# EAGLE design board (EAGLE 6.6.0)
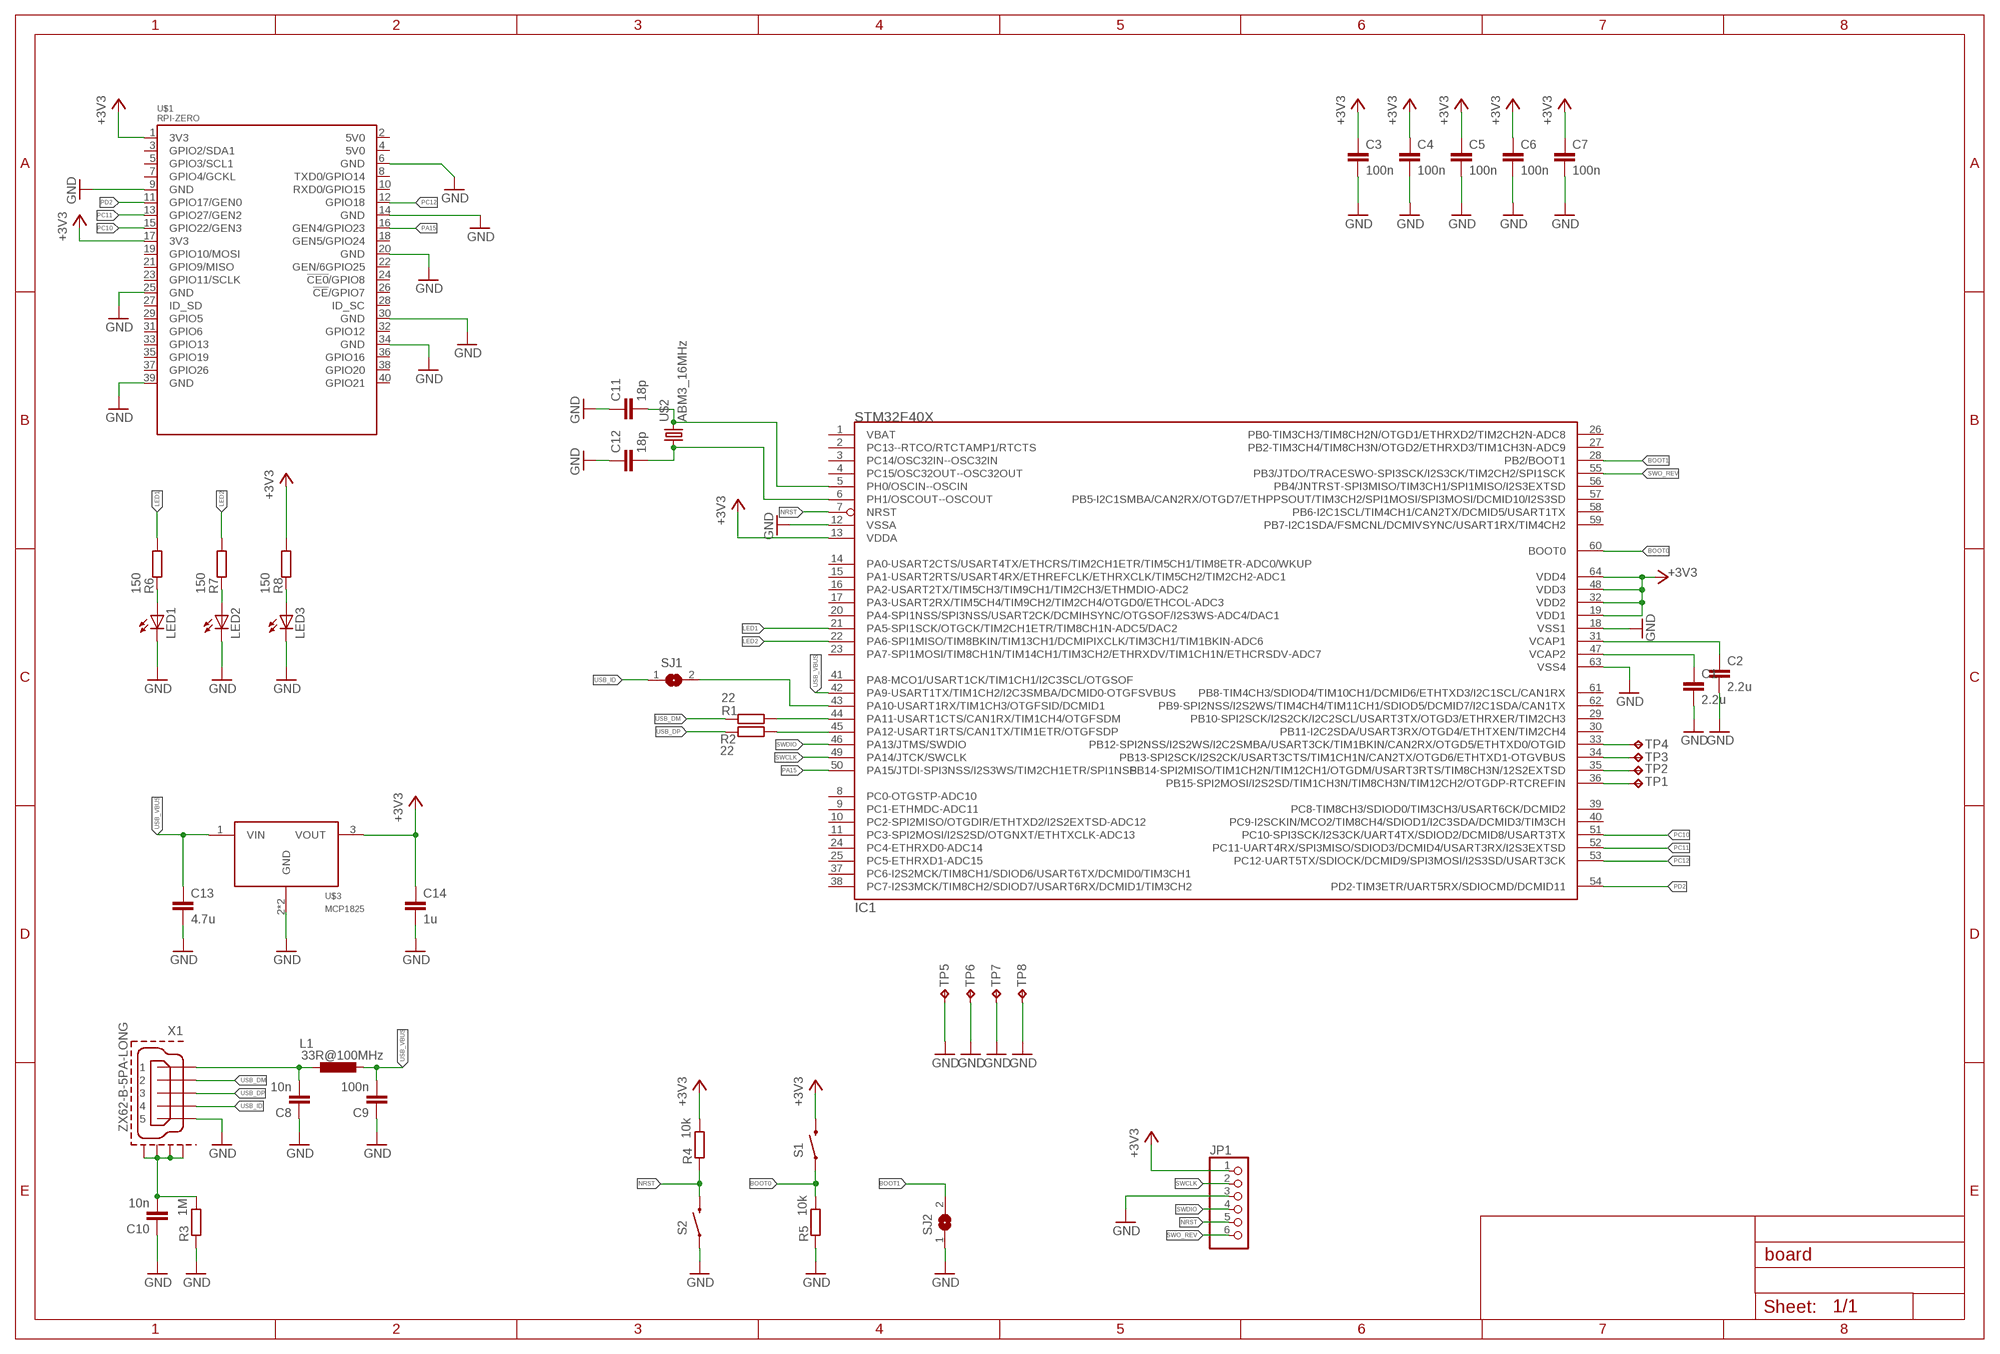
[diagram p0: schematic, sheet 1]

## Parts
C1  2.2u  C-EUC0805  [C0805]
C2  2.2u  C-EUC0805  [C0805]
C3  100n  C-EUC0603  [C0603]
C4  100n  C-EUC0603  [C0603]
C5  100n  C-EUC0603  [C0603]
C6  100n  C-EUC0603  [C0603]
C7  100n  C-EUC0603  [C0603]
C8  10n  C-EUC0603  [C0603]
C9  100n  C-EUC0603  [C0603]
C10  10n  C-EUC0603  [C0603]
C11  18p  C-EUC0603  [C0603]
C12  18p  C-EUC0603  [C0603]
C13  4.7u  C-EUC0805  [C0805]
C14  1u  C-EUC0805  [C0805]
IC1  STM32F40X  [LQFP64]
JP1  PINHD-1X6  [1X06]
L1  33R@100MHz  L-EUL2012C  [L2012C]
LED1  LEDCHIPLED_0805  [CHIPLED_0805]
LED2  LEDCHIPLED_0805  [CHIPLED_0805]
LED3  LEDCHIPLED_0805  [CHIPLED_0805]
R1  22  R-EU_R0603  [R0603]
R2  22  R-EU_R0603  [R0603]
R3  1M  R-EU_R0603  [R0603]
R4  10k  R-EU_R0603  [R0603]
R5  10k  R-EU_R0603  [R0603]
R6  150  R-EU_R0603  [R0603]
R7  150  R-EU_R0603  [R0603]
R8  150  R-EU_R0603  [R0603]
S1  SWITCH-MOMENTARY-2SMD  [TACTILE-SWITCH-SMD]
S2  SWITCH-MOMENTARY-2SMD  [TACTILE-SWITCH-SMD]
SJ1  SJ  [SJ]
SJ2  SJ  [SJ]
TP1  TPB1,27  [B1,27]
TP2  TPB1,27  [B1,27]
TP3  TPB1,27  [B1,27]
TP4  TPB1,27  [B1,27]
TP5  TPB1,27  [B1,27]
TP6  TPB1,27  [B1,27]
TP7  TPB1,27  [B1,27]
TP8  TPB1,27  [B1,27]
U$1  RPI-ZERO  [RASPBERRYPI_BASTELSTUBE_V13_RASPI_BOARD_B+_FULL]
U$2  ABM3_16MHz  ABRACON_ABM3_CRYSTAL  [ABRACON_ABM3_CRYSTAL]
U$3  MCP1825  [SOT223-3]
X1  ZX62-B-5PA-LONG  [ZX62-B-5PA-LONG]

## Nets
+3V3: C3.1 C4.1 C5.1 C6.1 C7.1 C14.1 IC1.13(VDDA) IC1.19(VDD1) IC1.32(VDD2) IC1.48(VDD3) IC1.64(VDD4) JP1.1 R4.2 R8.2 S1.3 U$1.1(3V3) U$1.17(3V3) U$3.3(VOUT)
BOOT0: IC1.60(BOOT0) R5.2 S1.1
BOOT1: IC1.28(PB2/BOOT1) SJ2.2
GND: C1.2 C2.2 C3.2 C4.2 C5.2 C6.2 C7.2 C8.1 C9.1 C10.1 C11.1 C12.1 C13.2 C14.2 IC1.12(VSSA) IC1.18(VSS1) IC1.63(VSS4) JP1.3 LED1.C LED2.C LED3.C R3.1 R5.1 S2.1 SJ2.1 TP5.TP TP6.TP TP7.TP TP8.TP U$1.6(GND) U$1.9(GND) U$1.14(GND) U$1.20(GND) U$1.25(GND) U$1.30(GND) U$1.34(GND) U$1.39(GND) U$3.2(GND) U$3.4(GND) X1.5
LED1: IC1.21(PA5-SPI1SCK/OTGCK/TIM2CH1ETR/TIM8CH1N-ADC5/DAC2) R6.2
LED2: IC1.22(PA6-SPI1MISO/TIM8BKIN/TIM13CH1/DCMIPIXCLK/TIM3CH1/TIM1BKIN-ADC6) R7.2
N$1: C8.2 L1.1 X1.1
N$2: C10.2 R3.2 X1.P$1(GND1) X1.P$2(GND2) X1.P$5(GND4) X1.P$6(GND3)
N$3: IC1.44(PA11-USART1CTS/CAN1RX/TIM1CH4/OTGFSDM) R1.2
N$4: IC1.45(PA12-USART1RTS/CAN1TX/TIM1ETR/OTGFSDP) R2.2
N$5: IC1.43(PA10-USART1RX/TIM1CH3/OTGFSID/DCMID1) SJ1.2
N$6: LED1.A R6.1
N$7: C12.2 IC1.6(PH1/OSCOUT--OSCOUT) U$2.P$1
N$8: C11.2 IC1.5(PH0/OSCIN--OSCIN) U$2.P$2
N$9: LED2.A R7.1
N$10: LED3.A R8.1
N$11: IC1.36(PB15-SPI2MOSI/I2S2SD/TIM1CH3N/TIM8CH3N/TIM12CH2/OTGDP-RTCREFIN) TP1.TP
N$12: IC1.35(PB14-SPI2MISO/TIM1CH2N/TIM12CH1/OTGDM/USART3RTS/TIM8CH3N/12S2EXTSD) TP2.TP
N$13: IC1.34(PB13-SPI2SCK/I2S2CK/USART3CTS/TIM1CH1N/CAN2TX/OTGD6/ETHTXD1-OTGVBUS) TP3.TP
N$14: IC1.33(PB12-SPI2NSS/I2S2WS/I2C2SMBA/USART3CK/TIM1BKIN/CAN2RX/OTGD5/ETHTXD0/OTGID) TP4.TP
NRST: IC1.7(NRST) JP1.5 R4.1 S2.3
PA15: IC1.50(PA15/JTDI-SPI3NSS/I2S3WS/TIM2CH1ETR/SPI1NSS) U$1.16(GEN4/GPIO23)
PC10: IC1.51(PC10-SPI3SCK/I2S3CK/UART4TX/SDIOD2/DCMID8/USART3TX) U$1.15(GPIO22/GEN3)
PC11: IC1.52(PC11-UART4RX/SPI3MISO/SDIOD3/DCMID4/USART3RX/I2S3EXTSD) U$1.13(GPIO27/GEN2)
PC12: IC1.53(PC12-UART5TX/SDIOCK/DCMID9/SPI3MOSI/I2S3SD/USART3CK) U$1.12(GPIO18)
PD2: IC1.54(PD2-TIM3ETR/UART5RX/SDIOCMD/DCMID11) U$1.11(GPIO17/GEN0)
SWCLK: IC1.49(PA14/JTCK/SWCLK) JP1.2
SWDIO: IC1.46(PA13/JTMS/SWDIO) JP1.4
SWO_REV: IC1.55(PB3/JTDO/TRACESWO-SPI3SCK/I2S3CK/TIM2CH2/SPI1SCK) JP1.6
USB_DM: R1.1 X1.2
USB_DP: R2.1 X1.3
USB_ID: SJ1.1 X1.4
USB_VBUS: C9.2 C13.1 IC1.42(PA9-USART1TX/TIM1CH2/I2C3SMBA/DCMID0-OTGFSVBUS) L1.2 U$3.1(VIN)
VCAP1: C2.1 IC1.31(VCAP1)
VCAP2: C1.1 IC1.47(VCAP2)
Unconnected: IC1.1(VBAT) IC1.2(PC13--RTCO/RTCTAMP1/RTCTS) IC1.3(PC14/OSC32IN--OSC32IN) IC1.4(PC15/OSC32OUT--OSC32OUT) IC1.8(PC0-OTGSTP-ADC10) IC1.9(PC1-ETHMDC-ADC11) IC1.10(PC2-SPI2MISO/OTGDIR/ETHTXD2/I2S2EXTSD-ADC12) IC1.11(PC3-SPI2MOSI/I2S2SD/OTGNXT/ETHTXCLK-ADC13) IC1.14(PA0-USART2CTS/USART4TX/ETHCRS/TIM2CH1ETR/TIM5CH1/TIM8ETR-ADC0/WKUP) IC1.15(PA1-USART2RTS/USART4RX/ETHREFCLK/ETHRXCLK/TIM5CH2/TIM2CH2-ADC1) IC1.16(PA2-USART2TX/TIM5CH3/TIM9CH1/TIM2CH3/ETHMDIO-ADC2) IC1.17(PA3-USART2RX/TIM5CH4/TIM9CH2/TIM2CH4/OTGD0/ETHCOL-ADC3) IC1.20(PA4-SPI1NSS/SPI3NSS/USART2CK/DCMIHSYNC/OTGSOF/I2S3WS-ADC4/DAC1) IC1.23(PA7-SPI1MOSI/TIM8CH1N/TIM14CH1/TIM3CH2/ETHRXDV/TIM1CH1N/ETHCRSDV-ADC7) IC1.24(PC4-ETHRXD0-ADC14) IC1.25(PC5-ETHRXD1-ADC15) IC1.26(PB0-TIM3CH3/TIM8CH2N/OTGD1/ETHRXD2/TIM2CH2N-ADC8) IC1.27(PB2-TIM3CH4/TIM8CH3N/OTGD2/ETHRXD3/TIM1CH3N-ADC9) IC1.29(PB10-SPI2SCK/I2S2CK/I2C2SCL/USART3TX/OTGD3/ETHRXER/TIM2CH3) IC1.30(PB11-I2C2SDA/USART3RX/OTGD4/ETHTXEN/TIM2CH4) IC1.37(PC6-I2S2MCK/TIM8CH1/SDIOD6/USART6TX/DCMID0/TIM3CH1) IC1.38(PC7-I2S3MCK/TIM8CH2/SDIOD7/USART6RX/DCMID1/TIM3CH2) IC1.39(PC8-TIM8CH3/SDIOD0/TIM3CH3/USART6CK/DCMID2) IC1.40(PC9-I2SCKIN/MCO2/TIM8CH4/SDIOD1/I2C3SDA/DCMID3/TIM3CH) IC1.41(PA8-MCO1/USART1CK/TIM1CH1/I2C3SCL/OTGSOF) IC1.56(PB4/JNTRST-SPI3MISO/TIM3CH1/SPI1MISO/I2S3EXTSD) IC1.57(PB5-I2C1SMBA/CAN2RX/OTGD7/ETHPPSOUT/TIM3CH2/SPI1MOSI/SPI3MOSI/DCMID10/I2S3SD) IC1.58(PB6-I2C1SCL/TIM4CH1/CAN2TX/DCMID5/USART1TX) IC1.59(PB7-I2C1SDA/FSMCNL/DCMIVSYNC/USART1RX/TIM4CH2) IC1.61(PB8-TIM4CH3/SDIOD4/TIM10CH1/DCMID6/ETHTXD3/I2C1SCL/CAN1RX) IC1.62(PB9-SPI2NSS/I2S2WS/TIM4CH4/TIM11CH1/SDIOD5/DCMID7/I2C1SDA/CAN1TX) U$1.2(5V0) U$1.3(GPIO2/SDA1) U$1.4(5V0) U$1.5(GPIO3/SCL1) U$1.7(GPIO4/GCKL) U$1.8(TXD0/GPIO14) U$1.10(RXD0/GPIO15) U$1.18(GEN5/GPIO24) U$1.19(GPIO10/MOSI) U$1.21(GPIO9/MISO) U$1.22(GEN/6GPIO25) U$1.23(GPIO11/SCLK) U$1.24(!CE0!/GPIO8) U$1.26(!CE!/GPIO7) U$1.27(ID_SD) U$1.28(ID_SC) U$1.29(GPIO5) U$1.31(GPIO6) U$1.32(GPIO12) U$1.33(GPIO13) U$1.35(GPIO19) U$1.36(GPIO16) U$1.37(GPIO26) U$1.38(GPIO20) U$1.40(GPIO21)

## Library data of the parts
C1-C14 = rcl:C-EU: CAPACITOR, European symbol
IC1 = pel_stm32:STM32F40X
JP1 = pinhead:PINHD-1X6: PIN HEADER
L1 = rcl:L-EU: INDUCTOR, European symbol
LED1-LED3 = led:LED: LED OSRAM: - CHIPLED LG R971, LG N971, LY N971, LG Q971, LY Q971, LO R971, LY R971 LH N974, LH R974 LS Q976, LO Q976, LY Q976 LO Q996 - Hyper CHIPLED LW Q18S LB Q993, LB Q99A, LB R99A - SideLED LS A670, LO A670, LY A670, LG A670, LP A670 LB A673, LV A673, LT A673, LW A673 LH A674 LY A675 LS A676, LA A676, LO A676, LY A676, LW A676 LS A679, LY A679, LG A679 - Hyper Micro SIDELED® LS Y876, LA Y876, LO Y876, LY Y876 LT Y87S - SmartLED LW L88C, LW L88S LB L89C, LB L89S, LG L890 LS L89K, LO L89K, LY L89K LS L896, LA L896, LO L896, LY L896 - TOPLED LS T670, LO T670, LY T670, LG T670, LP T670 LSG T670, LSP T670, LSY T670, LOP T670, LYG T670 LG T671, LOG T671, LSG T671 LB T673, LV T673, LT T673, LW T673 LH T674 LS T676, LA T676, LO T676, LY T676, LB T676, LH T676, LSB T676, LW T676 LB T67C, LV T67C, LT T67C, LS T67K, LO T67K, LY T67K, LW E67C LS E67B, LA E67B, LO E67B, LY E67B, LB E67C, LV E67C, LT E67C LW T67C LS T679, LY T679, LG T679 LS T770, LO T770, LY T770, LG T770, LP T770 LB T773, LV T773, LT T773, LW T773 LH T774 LS E675, LA E675, LY E675, LS T675 LS T776, LA T776, LO T776, LY T776, LB T776 LHGB T686 LT T68C, LB T68C - Hyper Mini TOPLED® LB M676 - Mini TOPLED Santana® LG M470 LS M47K, LO M47K, LY M47K Source: http://www.osram.convergy.de LUXEON: - LUMILED® LXK2-PW12-R00, LXK2-PW12-S00, LXK2-PW14-U00, LXK2-PW14-V00 LXK2-PM12-R00, LXK2-PM12-S00, LXK2-PM14-U00 LXK2-PE12-Q00, LXK2-PE12-R00, LXK2-PE12-S00, LXK2-PE14-T00, LXK2-PE14-U00 LXK2-PB12-K00, LXK2-PB12-L00, LXK2-PB12-M00, LXK2-PB14-N00, LXK2-PB14-P00, LXK2-PB14-Q00 LXK2-PR12-L00, LXK2-PR12-M00, LXK2-PR14-Q00, LXK2-PR14-R00 LXK2-PD12-Q00, LXK2-PD12-R00, LXK2-PD12-S00 LXK2-PH12-R00, LXK2-PH12-S00 LXK2-PL12-P00, LXK2-PL12-Q00, LXK2-PL12-R00 Source: www.luxeon.com KINGBRIGHT: KA-3528ASYC Source: www.kingbright.com
R1-R8 = rcl:R-EU_: RESISTOR, European symbol
S1 S2 = SparkFun-Electromechanical:SWITCH-MOMENTARY-2: Various NO switches- pushbuttons, reed, etc; PROD_ID: SWCH-08247
SJ1 SJ2 = jumper:SJ: SMD solder JUMPER
TP1-TP8 = testpad:TP: Test pad
U$1 = RPI-Zero:RPI-ZERO
U$2 = Ava:ABRACON_ABM3_CRYSTAL
U$3 = mcp1825:MCP1825
X1 = Hirose-USB:ZX62-B-5PA

## Board
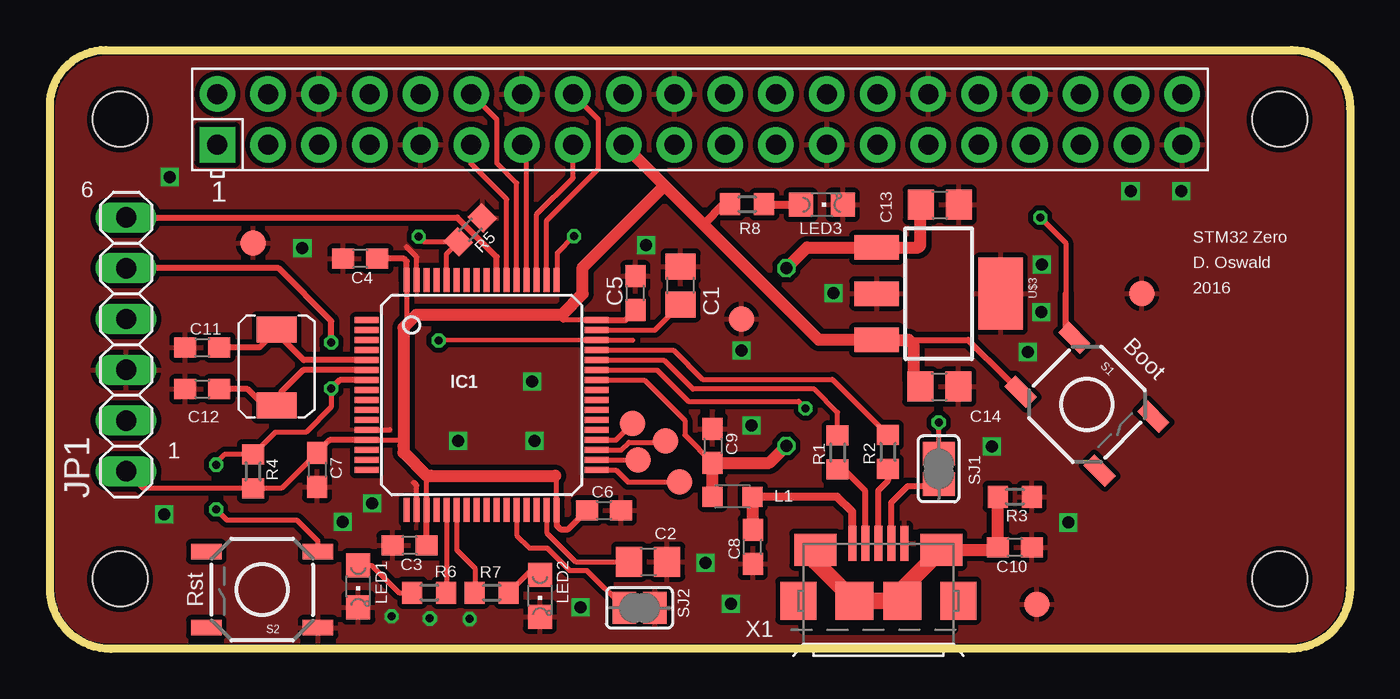
[diagram p1: board, top side]
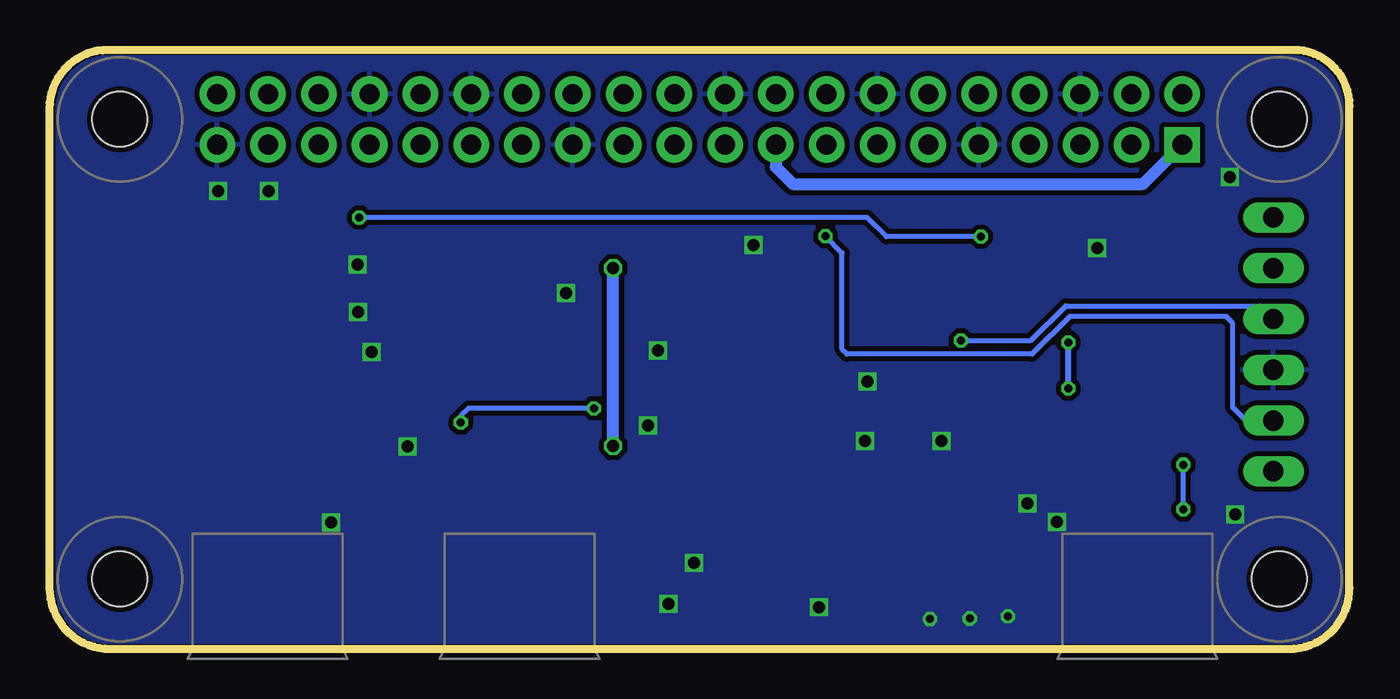
[diagram p2: board, bottom side, seen from below]

Size 65 x 29.97 mm. Coordinates in mm from the lower left corner, seen from the top.
Outline: 0,27.03 arc-90 2.95,29.97 62.03,29.97 arc-90 65,27 65,3.05 arc-90 61.95,0 3,0 arc-90 0,3 0,27.03
Copper layers (1*16): Top 0.035mm / dielectric 1.5mm / Bottom 0.035mm
Design rules "dirt_cheap_dirty_boards.v1": minimum track width 5mil, minimum drill 12mil, track to track 5mil, track to pad 5mil, pad to pad 5mil, via to via 5mil, smd to smd 0mil, copper to edge 10mil, drill to drill 10mil, minimum pad ring 10mil, minimum via ring 6mil, stop-mask expansion 2mil, vias tented up to drill 25mil, thermal gap 10mil
Milling: 8 lines

### Footprints (pad centres in the part's own frame; a part is rotated, then mirrored left to right if it is on the bottom)
C0805 = smd 1.3 x 1.5: 1 -0.95,0; 2 0.95,0
C0603 = smd 1.1 x 1: 1 -0.85,0; 2 0.85,0
LQFP64 = smd 1.2 x 0.3: 1 -5.75,3.75; 2 -5.75,3.25; 3 -5.75,2.75; 4 -5.75,2.25; 5 -5.75,1.75; 6 -5.75,1.25; 7 -5.75,0.75; 8 -5.75,0.25; 9 -5.75,-0.25; 10 -5.75,-0.75; 11 -5.75,-1.25; 12 -5.75,-1.75; 13 -5.75,-2.25; 14 -5.75,-2.75; 15 -5.75,-3.25; 16 -5.75,-3.75; 33 5.75,-3.75; 34 5.75,-3.25; 35 5.75,-2.75; 36 5.75,-2.25; 37 5.75,-1.75; 38 5.75,-1.25; 39 5.75,-0.75; 40 5.75,-0.25; 41 5.75,0.25; 42 5.75,0.75; 43 5.75,1.25; 44 5.75,1.75; 45 5.75,2.25; 46 5.75,2.75; 47 5.75,3.25; 48 5.75,3.75 | smd 0.3 x 1.2: 17 -3.75,-5.75; 18 -3.25,-5.75; 19 -2.75,-5.75; 20 -2.25,-5.75; 21 -1.75,-5.75; 22 -1.25,-5.75; 23 -0.75,-5.75; 24 -0.25,-5.75; 25 0.25,-5.75; 26 0.75,-5.75; 27 1.25,-5.75; 28 1.75,-5.75; 29 2.25,-5.75; 30 2.75,-5.75; 31 3.25,-5.75; 32 3.75,-5.75; 49 3.75,5.75; 50 3.25,5.75; 51 2.75,5.75; 52 2.25,5.75; 53 1.75,5.75; 54 1.25,5.75; 55 0.75,5.75; 56 0.25,5.75; 57 -0.25,5.75; 58 -0.75,5.75; 59 -1.25,5.75; 60 -1.75,5.75; 61 -2.25,5.75; 62 -2.75,5.75; 63 -3.25,5.75; 64 -3.75,5.75
1X06 = drill 1.016 long: 1 -6.35,0; 2 -3.81,0; 3 -1.27,0; 4 1.27,0; 5 3.81,0; 6 6.35,0
L2012C = smd 1 x 1: 1 -1,0; 2 1,0
CHIPLED_0805 = smd 1.2 x 1.2: A 0,-1.05; C 0,1.05
R0603 = smd 1 x 1.1: 1 -0.85,0; 2 0.85,0
TACTILE-SWITCH-SMD = smd 1.524 x 0.762: 1 -2.794,1.905; 2 2.794,1.905; 3 -2.794,-1.905; 4 2.794,-1.905
SJ = smd 1.168 x 1.6: 1 -0.762,0; 2 0.762,0
B1,27 = smd 1.27 x 1.27: TP 0,0
RASPBERRYPI_BASTELSTUBE_V13_RASPI_BOARD_B+_FULL = drill 1 pad 1.778 square: 1 8.37,25.23 | drill 1 pad 1.778: 2 8.37,27.77; 3 10.91,25.23; 4 10.91,27.77; 5 13.45,25.23; 6 13.45,27.77; 7 15.99,25.23; 8 15.99,27.77; 9 18.53,25.23; 10 18.53,27.77; 11 21.07,25.23; 12 21.07,27.77; 13 23.61,25.23; 14 23.61,27.77; 15 26.15,25.23; 16 26.15,27.77; 17 28.69,25.23; 18 28.69,27.77; 19 31.23,25.23; 20 31.23,27.77; 21 33.77,25.23; 22 33.77,27.77; 23 36.31,25.23; 24 36.31,27.77; 25 38.85,25.23; 26 38.85,27.77; 27 41.39,25.23; 28 41.39,27.77; 29 43.93,25.23; 30 43.93,27.77; 31 46.47,25.23; 32 46.47,27.77; 33 49.01,25.23; 34 49.01,27.77; 35 51.55,25.23; 36 51.55,27.77; 37 54.09,25.23; 38 54.09,27.77; 39 56.63,25.23; 40 56.63,27.77 | hole 2.75: 3.5,3.5; 3.5,26.5; 61.5,3.5; 61.5,26.5
ABRACON_ABM3_CRYSTAL = smd 1.3 x 2: P$1 -3.4,0.1; P$2 0.4,0.1
SOT223-3 = smd 1.219 x 2.235: 1 0.229,-8.179; 2 2.54,-8.179; 3 4.851,-8.179 | smd 3.6 x 2.2: 4 2.54,-1.981
ZX62-B-5PA-LONG = smd 0.4 x 1.75: 1 -1.3,2.875; 2 -0.65,2.875; 3 0,2.875; 4 0.65,2.875; 5 1.3,2.875 | smd 2.1 x 1.6: P$1 -3.15,2.55; P$2 3.15,2.55 | smd 1.8 x 1.9: P$3 -4,0; P$4 4,0 | smd 1.9 x 1.9: P$5 -1.2,0; P$6 1.2,0

### Placement (x,y rotation side)
C1  31.55,18.19 90 top
C2  29.92,4.37 0 top
C3  17.98,5.18 180 top
C4  15.52,19.53 180 top
C5  29.29,17.81 90 top
C6  27.71,6.93 0 top
C7  13.36,8.97 270 top
C8  35.15,5.11 90 top
C9  33.15,10.16 270 top
C10  48.26,5.08 180 top
C11  7.62,15.09 0 top
C12  7.62,13 0 top
C13  44.5,22.23 0 top
C14  44.48,13.13 0 top
IC1  21.59,12.7 0 top
JP1  3.81,15.24 90 top
L1  34.14,7.62 180 top
LED1  15.42,3.12 180 top
LED2  24.51,2.67 180 top
LED3  38.61,22.23 270 top
R1  39.4,9.83 90 top
R2  41.91,9.86 90 top
R3  48.26,7.62 180 top
R4  10.16,8.89 270 top
R5  21.03,20.97 225 top
R6  18.97,2.82 0 top
R7  22.1,2.82 180 top
R8  34.87,22.25 180 top
S1  51.87,12.24 315 top
S2  10.62,2.97 180 top
SJ1  44.45,9.02 90 top
SJ2  29.49,2.06 180 top
TP1  29.13,11.28 0 top
TP2  30.78,10.41 0 top
TP3  29.41,9.45 0 top
TP4  31.5,8.36 0 top
TP5  54.61,17.78 0 top
TP6  49.35,2.24 0 top
TP7  10.16,20.32 0 top
TP8  34.59,16.51 0 top
U$1  0,0 0 top
U$2  11.43,15.6 90 top
U$3  49.53,20.32 270 top
X1  41.43,2.41 0 top

### Tracks (layer width: path | path; a pad name or v marks a point on that pad's centre or on a via)
+3V3
  Top 0.254: IC1.48 25.66,16.45 25.4,16.71 | IC1.64 17.84,16.45 17.95,16.34 | IC1.13 17.39,10.45 arc-90 17.68,10.16 | IC1.19 18.84,8.45 arc-90 19.05,8.66 | IC1.32 25.34,8.59 arc90 25.27,8.66 | C7.1 11.58,8.04 R4.2 4.66,8.04 JP1.1
  Top 0.305: IC1.13 13.99,10.45 C7.1 | C3.1 IC1.19 | IC1.32 25.34,6.18 25.53,5.99 25.92,5.99 C6.1 | IC1.48 28.78,16.45 C5.1 | IC1.64 17.84,19.4 17.7,19.53 C4.1 | 42.95,15.47 45.92,15.47 47.83,13.56 S1.3
  Top 0.406: R8.2 33.68,22.25 32.67,21.25
  Top 0.61: 30.74,23.18 32.67,21.25 38.45,15.47 U$3.3 42.95,15.47 43.18,15.24 43.18,13.48 C14.1 | 30.74,23.18 U$1.17 | 30.74,23.18 26.64,19.09 26.64,17.78 25.58,16.71 25.4,16.71 18.31,16.71 17.95,16.34 17.68,16.08 17.68,10.16 17.68,9.83 18.85,8.66 19.05,8.66 25.27,8.66
  Bottom 0.61: U$1.17 28.69,24.12 27.84,23.27 10.33,23.27 U$1.1
BOOT0  (via drill 0.4)
  Top 0.254: IC1.60 19.84,19.79 R5.2 18.7,20.37 v18.44,20.62 | v49.53,21.59 50.8,20.32 50.8,17.78
  Top 0.305: S1.1 50.8,16 50.8,17.78
  Bottom 0.254: v18.44,20.62 23.16,20.62 24.13,21.59 v49.53,21.59
BOOT1
  Top 0.254: SJ2.2 26.87,3.91 26.01,3.91 24.87,5.05 23.98,5.05 23.34,5.69 IC1.28
GND  (via drill 0.4, 0.6)
  Top 0.254: IC1.63 18.34,19.61 17.83,20.12 | 18.21,8.33 18.34,8.2 IC1.18 18.34,8.18 18.19,8.33 | IC1.12 16.97,10.95 16.99,10.97
  other vias: 48.92,14.86 49.61,19.23 49.58,16.87 56.59,22.91 54.05,22.91 5.99,23.62 5.71,6.73 34.06,2.26 32.79,4.32 26.54,2.08 17.09,1.63 19,1.52 20.98,1.5 14.63,6.35 20.42,10.41 16.1,7.29 24.23,10.41 24.1,13.39 50.93,6.32 47.12,10.13 35.08,11.18 29.82,20.22 34.59,14.94 39.19,17.81 12.62,20.07
  pour Top (isolate 0.254): 0,26.67 0,27.3 arc-90 2.77,30.07 62.18,30.07 arc-90 65.28,26.97 65.28,3.35 arc-90 61.77,-0.15 3.38,-0.15 arc-90 -0.05,3.28 -0.05,26.62 arc-90
  pour Bottom (isolate 0.254): 0,26.67 0,27.03 arc-90 3,30.02 62.03,30.02 arc-90 65.02,27.03 65.02,3.17 arc-90 61.87,0.03 3.07,0.03 arc-90 -0.15,3.25 -0.15,26.52 arc-90
LED1
  Top 0.254: IC1.21 19.84,2.84 R6.2
LED2
  Top 0.254: IC1.22 20.34,4.96 21.26,4.04 21.26,2.83 R7.2
N$1
  Top 0.406: X1.1 40.13,6.86 39.37,7.62 L1.1
  Top 0.61: C8.2 35.15,7.6 L1.1
N$2
  Top 0.61: X1.P$2 47.29,4.96 C10.2 R3.2
  Top 0.813: X1.P$1 38.28,4.36 X1.P$5 X1.P$6 42.63,3.01 X1.P$2
N$3
  Top 0.254: R1.2 39.4,11.84 38.23,13.01 32.16,13.01 30.71,14.45 IC1.44
N$4
  Top 0.254: IC1.45 31.18,14.95 32.64,13.49 39.13,13.49 R2.2
N$5  (via drill 0.4)
  Top 0.254: IC1.43 30.37,13.95 31.93,12.39 37.44,12.39 v37.8,12.04 | SJ1.2 v44.45,11.33
  Bottom 0.254: v37.8,12.04 44.07,12.04 44.45,11.66 v44.45,11.33
N$6
  Top 0.254: LED1.A 16.09,4.17 17.45,2.82 R6.1
N$7
  Top 0.305: IC1.6 12.65,13.95 11.58,12.88 11.58,12.45 U$2.P$1 11.15,11.73 9.88,13.01 C12.2
N$8
  Top 0.305: IC1.5 12.7,14.45 11.33,15.82 U$2.P$2 11.17,15.77 10.48,15.09 C11.2
N$9
  Top 0.254: LED2.A 24,3.87 R7.1
N$10
  Top 0.406: R8.1 35.75,22.23 LED3.A
N$11
  Top 0.254: IC1.36 28.31,10.45 TP1.TP
N$12
  Top 0.254: IC1.35 28.57,9.95 28.96,10.34 30.89,10.34 TP2.TP 30.63,10.34
N$13
  Top 0.254: IC1.34 29.18,9.45 TP3.TP
N$14
  Top 0.254: IC1.33 28.31,8.95 28.91,8.36 TP4.TP
NRST  (via drill 0.4)
  Top 0.254: v14.07,13.03 14.07,12.12 12.8,10.85 11.27,10.85 R4.1 8.75,9.74 8.31,9.3 v8.31,9.22 | S2.3 13.41,5.38 12.34,6.45 8.84,6.45 v8.31,6.99
  Top 0.305: IC1.7 14.49,13.45 v14.07,13.03 | v14.07,15.34 14.07,16.41 11.43,19.05 JP1.5
  Bottom 0.254: v8.31,6.99 v8.31,9.22
  Bottom 0.305: v14.07,13.03 v14.07,15.34
PA15
  Top 0.254: IC1.50 24.84,21.44 27.43,24.03 27.43,26.49 U$1.16
PC10
  Top 0.254: IC1.51 24.34,21.75 26.16,23.57 26.16,25.22 U$1.15
PC11
  Top 0.254: IC1.52 23.84,25 U$1.13
PC12
  Top 0.254: IC1.53 23.34,23.32 22.35,24.31 22.35,26.49 U$1.12
PD2
  Top 0.254: IC1.54 22.84,22.5 21.06,24.28 21.06,25.22 U$1.11
SWCLK  (via drill 0.4)
  Top 0.254: IC1.49 25.38,18.48 25.38,19.81 v26.21,20.65
  Bottom 0.254: JP1.2 5.18,11.43 5.84,12.09 5.84,16.31 6.17,16.64 13.99,16.64 15.88,14.76 25.15,14.76 25.38,14.99 25.38,19.81 v26.21,20.65
SWDIO  (via drill 0.4)
  Top 0.254: 29.15,15.45 IC1.46 v19.43,15.44
  Bottom 0.254: v19.43,15.44 15.93,15.44 14.2,17.17 4.47,17.17 JP1.4
SWO_REV
  Top 0.305: JP1.6 20.37,21.59 22.34,19.62 IC1.55
USB_DM
  Top 0.305: X1.2 40.78,7.9 39.7,8.98 R1.1
USB_DP
  Top 0.305: X1.3 41.43,7.92 41.91,8.41 R2.1
USB_ID
  Top 0.305: X1.4 42.08,7.33 42.9,8.15 44.35,8.15 SJ1.1
USB_VBUS  (via drill 0.6)
  Top 0.254: IC1.42 29.73,13.45 31.75,11.43 31.75,10.71 C9.2
  Top 0.61: L1.2 33.14,9.3 C9.2 35.98,9.31 v36.83,10.16 | v36.83,19.05 37.87,20.09 U$3.1 43.43,20.09 43.54,20.19 43.54,22.21 C13.1
  Bottom 0.61: v36.83,10.16 v36.83,19.05
VCAP1
  Top 0.254: IC1.31 24.84,5.82 26.29,4.37 C2.1
VCAP2
  Top 0.254: IC1.47 30.26,15.95 C1.1

### Text on the board
tNames: 6 | STM32 Zero | D. Oswald | 2016 | Boot | 1 | Rst